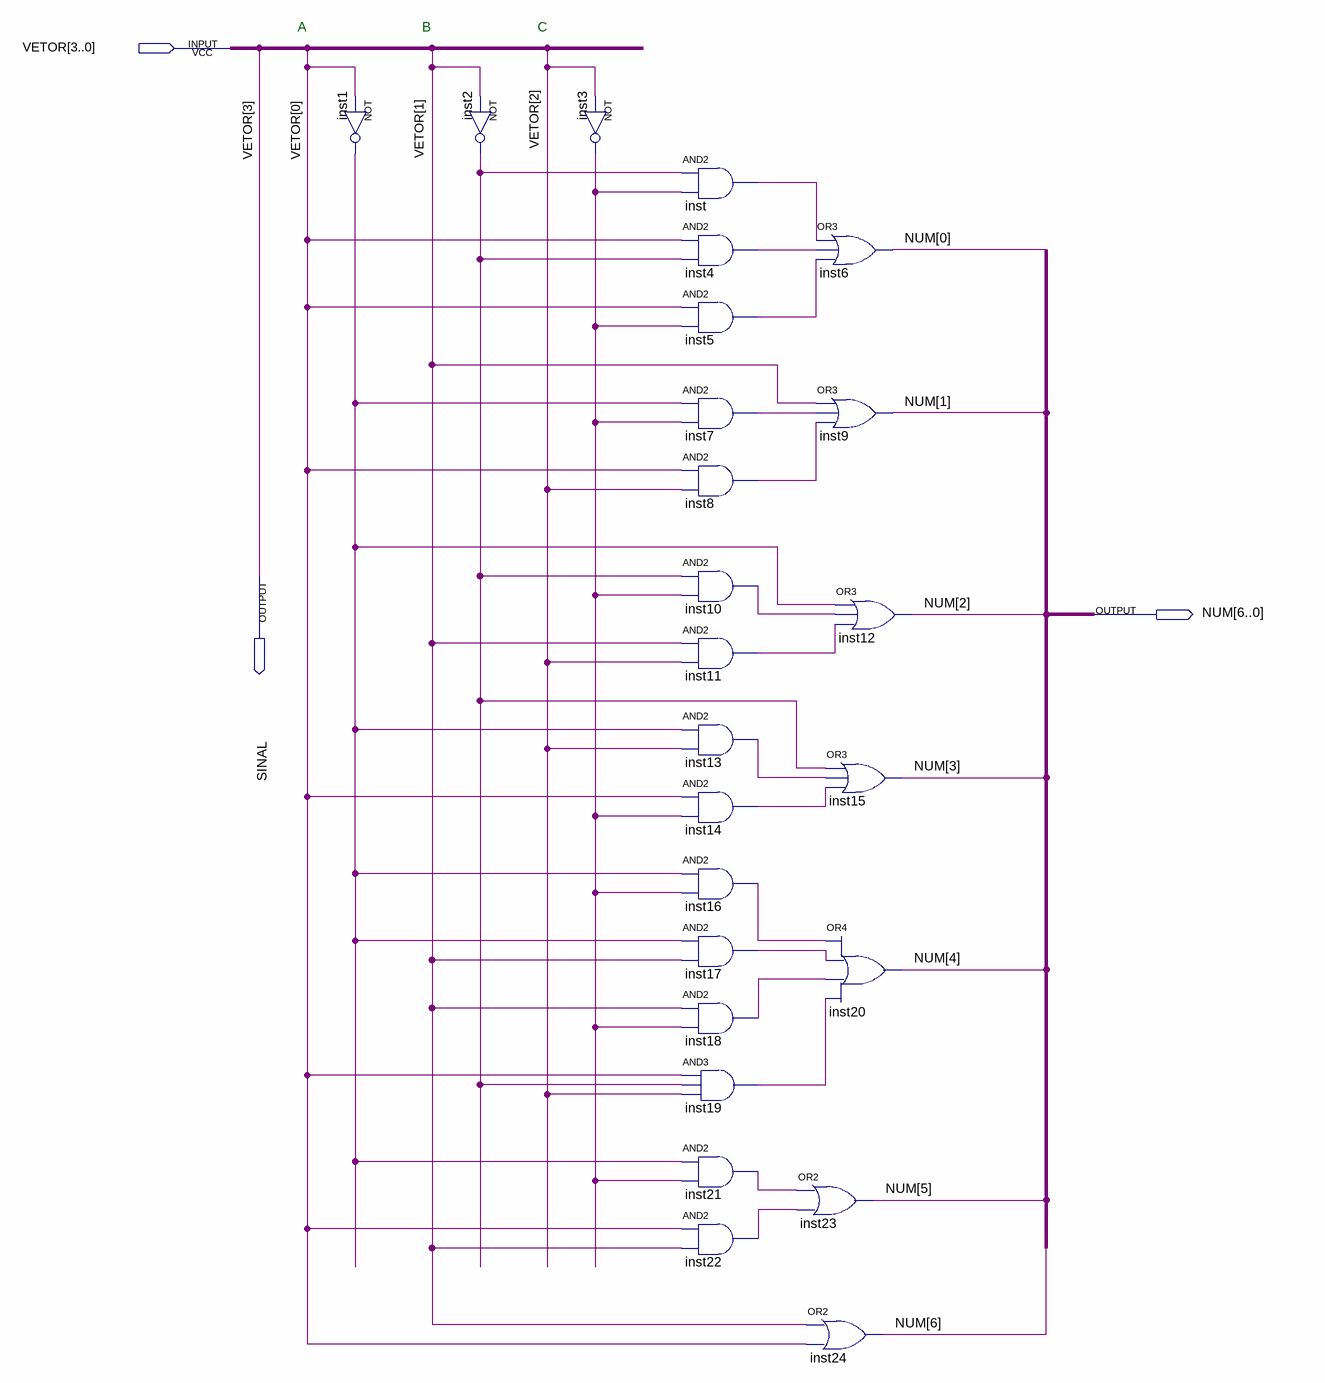
[diagram p0: schematic sheet]
// Quartus schematic DISPLAY.bdf as structural Verilog: 25 symbols, 3 pins
module DISPLAY (
  input  [3:0] VETOR,
  output SINAL,
  output [6:0] NUM
);

  wire inst1_out, inst2_out, inst3_out, inst4_out, inst5_out, inst7_out, inst8_out, inst10_out, inst11_out,
       inst13_out, inst14_out, inst16_out, inst17_out, inst18_out, inst19_out, inst21_out, inst22_out,
       inst_out;

  not inst1 (inst1_out, VETOR[0]);
  not inst2 (inst2_out, VETOR[1]);
  not inst3 (inst3_out, VETOR[2]);
  and inst (inst_out, inst2_out, inst3_out);
  and inst4 (inst4_out, VETOR[0], inst2_out);
  and inst5 (inst5_out, VETOR[0], inst3_out);
  and inst7 (inst7_out, inst1_out, inst3_out);
  and inst8 (inst8_out, VETOR[0], VETOR[2]);
  and inst10 (inst10_out, inst2_out, inst3_out);
  and inst11 (inst11_out, VETOR[1], VETOR[2]);
  and inst13 (inst13_out, inst1_out, VETOR[2]);
  and inst14 (inst14_out, VETOR[0], inst3_out);
  and inst16 (inst16_out, inst1_out, inst3_out);
  and inst17 (inst17_out, inst1_out, VETOR[1]);
  and inst18 (inst18_out, VETOR[1], inst3_out);
  and inst19 (inst19_out, VETOR[0], inst2_out, VETOR[2]);
  and inst21 (inst21_out, inst1_out, inst3_out);
  and inst22 (inst22_out, VETOR[0], VETOR[1]);
  or inst6 (NUM[0], inst_out, inst4_out, inst5_out);
  or inst9 (NUM[1], VETOR[1], inst7_out, inst8_out);
  or inst12 (NUM[2], inst1_out, inst10_out, inst11_out);
  or inst15 (NUM[3], inst2_out, inst13_out, inst14_out);
  or inst20 (NUM[4], inst16_out, inst17_out, inst18_out, inst19_out);
  or inst23 (NUM[5], inst21_out, inst22_out);
  or inst24 (NUM[6], VETOR[1], VETOR[0]);

  assign SINAL = VETOR[3];

  // Notes on the sheet:
  //   A
  //   B
  //   C
endmodule
